# Altium schematic sheet USB_UART.SchDoc: USB to UART interface
size A; Author: Ben Smith; CompanyName: CSUS FSAE - CPE187; DocumentName: USB to UART interface
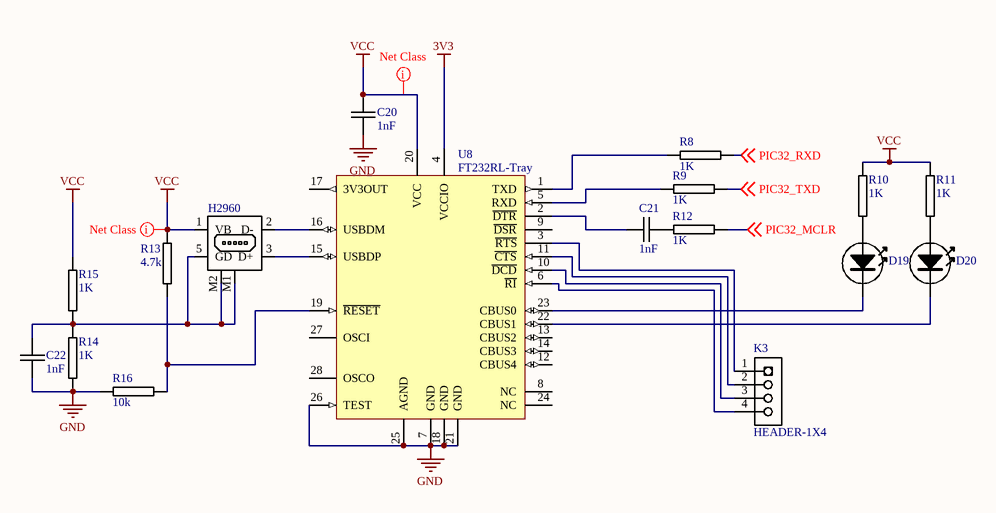
[diagram p0: USB_UART.SchDoc]

## Parts
C20  1nF  [0603C-GENERIC]
C21  1nF  [0603C-GENERIC]
C22  1nF  [0603C-GENERIC]
D19  TOPLED-RED  [TOPLED-RED]  (value not drawn)
D20  TOPLED-RED  [TOPLED-RED]  (value not drawn)
K1  H2960  [usb-mini-b]
K3  HEADER-1X4  [HEADER-1X4]
R8  1K  [0603R-1k]
R9  1K  [0603R-1k]
R10  1K  [0603R-1k]
R11  1K  [0603R-1k]
R12  1K  [0603R-1k]
R13  4.7k  [0603R-1k]
R14  1K  [0603R-1k]
R15  1K  [0603R-1k]
R16  10k  [0603R-1k]
U8  FT232RL-Tray  [SSOP-28_N]

## Nets
3V3: U8.4(VCCIO)
GND: C20.2 C22.2 R14.2 R16.2 U8.7(GND) U8.18(GND) U8.21(GND) U8.25(AGND) U8.26(TEST)
VCC: C20.1 K1.1(VB) R10.2 R11.2 R13.1 R15.1 U8.20(VCC)
PIC32_MCLR: R12.2 ; off-sheet PIC32_MCLR
PIC32_RXD: R8.2 ; off-sheet PIC32_RXD
PIC32_TXD: R9.2 ; off-sheet PIC32_TXD
NetC21_1: C21.1 U8.2(~{DTR})
NetC22_1: C22.1 K1.5(GD) K1.M1 K1.M2 R14.1 R15.2
NetD19_A: D19.A R10.1
NetD19_K: D19.K U8.23(CBUS0)
NetD20_A: D20.A R11.1
NetD20_K: D20.K U8.22(CBUS1)
NetK1_2: K1.2(D-) U8.16(USBDM)
NetK1_3: K1.3(D+) U8.15(USBDP)
NetK3_1: K3.1 U8.3(~{RTS})
NetK3_2: K3.2 U8.11(~{CTS})
NetK3_3: K3.3 U8.10(~{DCD})
NetK3_4: K3.4 U8.6(~{RI})
NetR8_1: R8.1 U8.1(TXD)
NetR9_1: R9.1 U8.5(RXD)
NetR13_2: R13.2 R16.1 U8.19(~{RESET})

Not connected (* = marked no-connect by the designer): C21 2; R12 1; U8 8(NC) 9(~{DSR}) 12(CBUS4) 13(CBUS2) 14(CBUS3) 17(3V3OUT) 24(NC) 27(OSCI) 28(OSCO)

## Layout directives
net class Power: VCC

## Library data of the parts
C20-C22 = 0603C-000: CAPACITOR 0603 CERAMIC
D19 D20 = TOPLED-RED: Manufacturer: OSRAM Opto Semiconductors Inc; Manufacturer Part Number: LS T676-Q1R2-1-Z; Reel: D13; Supplier 1: Digi-Key; Supplier Part Number 1: 475-1133-2-ND
K1 = USB-H2960: MINI USB B DEVICE CONNECTOR
R8-R16 = 0603R-1K: GENERIC RESISTOR 0603; Manufacturer Part Number: RMCF 1/16 1K 1% R; Manufacturer: Stackpole Electronics Inc; Reel: R14; Supplier 1: Digi-Key; Supplier Part Number 1: RMCF0603FT1K00TR-ND
U8 = FT232RL-Tray: USB UART Asynchronous Serial Data Transfer Chip, SSOP-28, Tray; Published: 19-Aug-2010; DatasheetVersion: ver 2.07, Jul-2010; PackageVersion: 2010; PackageReference: SSOP-28; Publisher: Altium Limited; PackageDescription: 28-Pin Small Outline Package 0.65 mm Pitch; ComponentLink1Description: Manufacturer Link; ComponentLink1URL: http://www.ftdichip.com/Products/ICs/FT232R.htm; ComponentLink2Description: Datasheet; ComponentLink2URL: http://www.ftdichip.com/Support/Documents/DataSheets/ICs/DS_FT232R.pdf
K3 = HEADER-1X4: Supplier 1: Digi-Key; Supplier Part Number 1: S1011E-36-ND